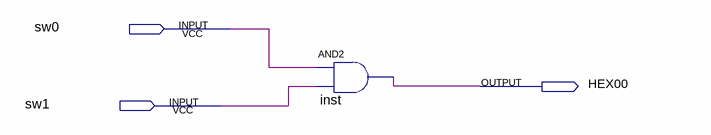
[diagram p0: schematic sheet]
// Quartus schematic extra_testing.bdf as structural Verilog: 1 symbols, 3 pins
module extra_testing (
  input  sw0,
  input  sw1,
  output HEX00
);

  and inst (HEX00, sw0, sw1);
endmodule
